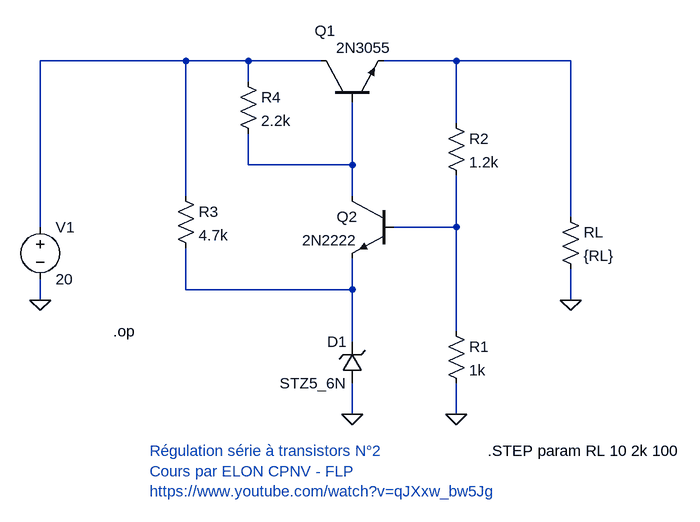
[diagram p0: schematic RegulSerieTransistors02.asc]
RegulSerieTransistors02.asc, the LTspice schematic file:
Version 4.1
SHEET 1 880 736
WIRE 48 -48 -176 -48
WIRE 144 -48 48 -48
WIRE 256 -48 144 -48
WIRE 464 -48 352 -48
WIRE 640 -48 464 -48
WIRE 144 -16 144 -48
WIRE 464 48 464 -48
WIRE 144 112 144 64
WIRE 304 112 304 16
WIRE 304 112 144 112
WIRE 48 160 48 -48
WIRE 304 160 304 112
WIRE 640 192 640 -48
WIRE -176 208 -176 -48
WIRE 464 208 464 128
WIRE 464 208 368 208
WIRE 48 304 48 240
WIRE 304 304 304 256
WIRE 304 304 48 304
WIRE -176 320 -176 288
WIRE 640 320 640 272
WIRE 464 368 464 208
WIRE 304 384 304 304
WIRE 304 496 304 448
WIRE 464 496 464 448
FLAG -176 320 0
FLAG 304 496 0
FLAG 464 496 0
FLAG 640 320 0
SYMBOL voltage -176 192 R0
WINDOW 123 0 0 Left 0
WINDOW 39 0 0 Left 0
SYMATTR InstName V1
SYMATTR Value 20
SYMBOL npn 256 16 R270
WINDOW 0 110 -10 VRight 2
WINDOW 3 84 23 VRight 2
SYMATTR InstName Q1
SYMATTR Value 2N3055
SYMBOL zener 320 448 R180
WINDOW 0 24 64 Left 2
WINDOW 3 24 0 Left 2
SYMATTR InstName D1
SYMATTR Value STZ5_6N
SYMBOL npn 368 160 M0
SYMATTR InstName Q2
SYMATTR Value 2N2222
SYMBOL res 448 352 R0
SYMATTR InstName R1
SYMATTR Value 1k
SYMBOL res 448 32 R0
SYMATTR InstName R2
SYMATTR Value 1.2k
SYMBOL res 32 144 R0
SYMATTR InstName R3
SYMATTR Value 4.7k
SYMBOL res 128 -32 R0
SYMATTR InstName R4
SYMATTR Value 2.2k
SYMBOL res 624 176 R0
SYMATTR InstName RL
SYMATTR Value {RL}
TEXT -8 552 Left 2 ;Régulation série à transistors N°2\nCours par ELON CPNV - FLP\nhttps://www.youtube.com/watch?v=qJXxw_bw5Jg
TEXT 512 552 Left 2 !.STEP param RL 10 2k 100
TEXT -64 368 Left 2 !.op

The netlist it stands for:
* RegulSerieTransistors02.asc
V1 N001 0 20
Q1 N001 N003 N002 0 2N3055
D1 0 N005 STZ5_6N
Q2 N003 N004 N005 0 2N2222
R1 N004 0 1k
R2 N002 N004 1.2k
R3 N001 N005 4.7k
R4 N001 N003 2.2k
RL N002 0 {RL}
.model D D
.lib standard.dio
.model NPN NPN
.model PNP PNP
.lib standard.bjt
* Régulation série à transistors N°2
* Cours par ELON CPNV - FLP
* https://www.youtube.com/watch?v=qJXxw_bw5Jg
.STEP param RL 10 2k 100
.op
.backanno
.end